# Altium schematic sheet legacy-main.SchDoc: audiolab
size A3; Author: Martín Ramírez Espinosa; Revision: 1.0; SheetNumber: 1; SheetTotal: 3
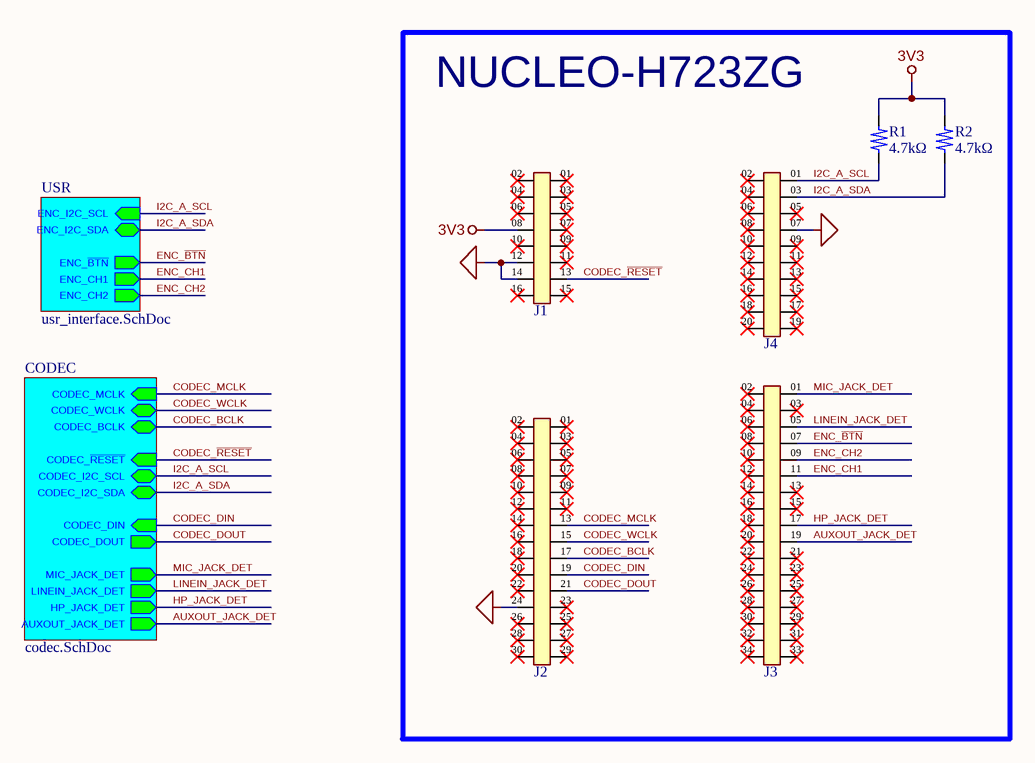
[diagram p0: legacy-main.SchDoc]

## Parts
J1  TSW-108-07-G-D  [SAMTEC_TSW-108-07-G-D]  (value not drawn)
J2  TSW-115-07-G-D  [SAMTEC_TSW-115-07-G-D]  (value not drawn)
J3  TSW-117-07-G-D-LL  [SAMTEC_TSW-117-07-G-D-LL]  (value not drawn)
J4  TSW-110-07-G-D  [SAMTEC_TSW-110-07-G-D]  (value not drawn)
R1  value 4.7kΩ  [RESC2012]  (hidden comment: RC0805FR-074K7L)
R2  value 4.7kΩ  [RESC2012]  (hidden comment: RC0805FR-074K7L)

## Blocks framed on the sheet
NUCLEO-H723ZG: J1-J4 R1 R2

## Sub-sheets
CODEC = codec.SchDoc: CODEC_~{RESET} (in), CODEC_I2C_SCL (bidir), CODEC_I2C_SDA (bidir), CODEC_DOUT (out), CODEC_DIN (in), CODEC_BCLK (bidir), CODEC_WCLK (bidir), CODEC_MCLK (in), MIC_JACK_DET (out), LINEIN_JACK_DET (out), HP_JACK_DET (out), AUXOUT_JACK_DET (out)
USR = usr_interface.SchDoc: ENC_~{BTN} (out), ENC_CH2 (out), ENC_CH1 (out), ENC_I2C_SCL (in), ENC_I2C_SDA (bidir)

## Nets
3V3: J1.08 R1.2 R2.2
DGND: J1.12 J1.14 J2.24 J4.07
AUXOUT_JACK_DET: J3.19 ; sheet CODEC/AUXOUT_JACK_DET
CODEC_BCLK: J2.17 ; sheet CODEC/CODEC_BCLK
CODEC_DIN: J2.19 ; sheet CODEC/CODEC_DIN
CODEC_DOUT: J2.21 ; sheet CODEC/CODEC_DOUT
CODEC_MCLK: J2.13 ; sheet CODEC/CODEC_MCLK
CODEC_~{RESET}: J1.13 ; sheet CODEC/CODEC_~{RESET}
CODEC_WCLK: J2.15 ; sheet CODEC/CODEC_WCLK
ENC_~{BTN}: J3.07 ; sheet USR/ENC_~{BTN}
ENC_CH1: J3.11 ; sheet USR/ENC_CH1
ENC_CH2: J3.09 ; sheet USR/ENC_CH2
HP_JACK_DET: J3.17 ; sheet CODEC/HP_JACK_DET
I2C_A_SCL: J4.01 R1.1 ; sheet USR/ENC_I2C_SCL, sheet CODEC/CODEC_I2C_SCL
I2C_A_SDA: J4.03 R2.1 ; sheet USR/ENC_I2C_SDA, sheet CODEC/CODEC_I2C_SDA
LINEIN_JACK_DET: J3.05 ; sheet CODEC/LINEIN_JACK_DET
MIC_JACK_DET: J3.01 ; sheet CODEC/MIC_JACK_DET

Not connected (* = marked no-connect by the designer): J1 01* 02* 03* 04* 05* 06* 07* 09* 10* 11* 15* 16*; J2 01* 02* 03* 04* 05* 06* 07* 08* 09* 10* 11* 12* 14* 16* 18* 20* 22* 23* 25* 26* 27* 28* 29* 30*; J3 02* 03* 04* 06* 08* 10* 12* 13* 14* 15* 16* 18* 20* 21* 22* 23* 24* 25* 26* 27* 28* 29* 30* 31* 32* 33* 34*; J4 02* 04* 05* 06* 08* 09* 10* 11* 12* 13* 14* 15* 16* 17* 18* 19* 20*

## Library data of the parts
J1 = TSW-108-07-G-D: Pin Header, Unshrouded, Board-to-Board, 2.54 mm, 2 Rows, 16 Contacts, Through Hole, TSW
J2 = TSW-115-07-G-D: Conn, Header, 30Pos, 2Row, 2.54Mm Rohs Compliant: Yes |Samtec, Inc. TSW-115-07-G-D
J3 = TSW-117-07-G-D-LL: Pin Header, Board-to-Board, 2.54 mm, 2 Rows, 34 Contacts, Through Hole, TSW Series
J4 = TSW-110-07-G-D: Pin Header, Vertical, Board-to-Board, 2.54 mm, 2 Rows, 20 Contacts, Through Hole, HTSW Series
R1 R2 = RC0805FR-074K7L: 125Mw Thick Film Resistors 100Ppm/ 1% 4.7K 0805 Chip Resistor Surface Mount Rohs; Manufacturer: YAGEO; Supplier: DigiKey; Supplier Part Number: 311-4.70KCRCT-ND; Manufacturer Part Number: RC0805FR-074K7L; Package/Case: 0805 (2012 Metric)